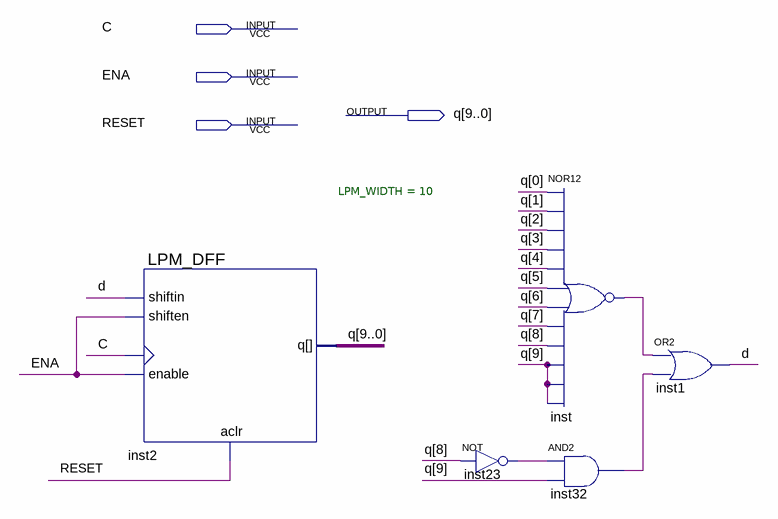
[diagram p0: schematic sheet]
// Quartus schematic shift_rg.bdf as structural Verilog: 5 symbols, 4 pins
module shift_rg (
  input  C,
  input  ENA,
  input  RESET,
  output [9:0] q
);

  wire d, inst23_out, inst32_out, inst_out;

  LPM_DFF #(.LPM_WIDTH(10)) inst2 (.aclr(RESET), .clock(C), .enable(ENA), .shiften(ENA), .shiftin(d), .q(q));
  not inst23 (inst23_out, q[8]);
  nor inst (inst_out, q[0], q[1], q[2], q[3], q[4], q[5], q[6], q[7], q[8], q[9], q[9], q[9]);
  and inst32 (inst32_out, inst23_out, q[9]);
  or inst1 (d, inst_out, inst32_out);
endmodule
